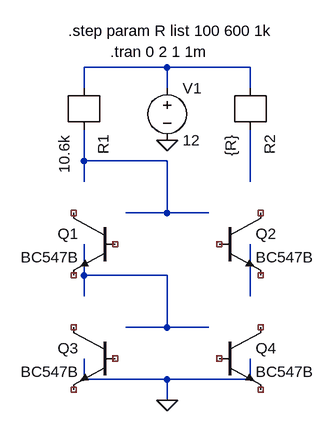
[diagram p0: schematic Marlon_1-2.asc]
Marlon_1-2.asc, the LTspice schematic file:
Version 4
SHEET 1 880 752
WIRE 288 224 160 224
WIRE 416 224 288 224
WIRE 160 256 160 224
WIRE 288 256 288 224
WIRE 416 256 416 224
WIRE 160 368 160 320
WIRE 288 368 160 368
WIRE 160 400 160 368
WIRE 416 400 416 320
WIRE 288 448 288 368
WIRE 288 448 224 448
WIRE 352 448 288 448
WIRE 160 544 160 496
WIRE 288 544 160 544
WIRE 160 576 160 544
WIRE 416 576 416 496
WIRE 288 624 288 544
WIRE 288 624 224 624
WIRE 352 624 288 624
WIRE 160 704 160 672
WIRE 288 704 160 704
WIRE 416 704 416 672
WIRE 416 704 288 704
WIRE 288 736 288 704
FLAG 288 336 0
FLAG 288 736 0
SYMBOL npn 208 448 M0
SYMATTR InstName Q1
SYMATTR Value BC547B
SYMBOL npn 368 448 R0
SYMATTR InstName Q2
SYMATTR Value BC547B
SYMBOL r 160 256 R90
SYMATTR InstName R1
SYMATTR Value 10.6k
SYMBOL r 416 256 R90
SYMATTR InstName R2
SYMATTR Value {R}
SYMBOL voltage 288 240 R0
SYMATTR InstName V1
SYMATTR Value 12
SYMBOL npn 208 624 M0
SYMATTR InstName Q3
SYMATTR Value BC547B
SYMBOL npn 368 624 R0
SYMATTR InstName Q4
SYMATTR Value BC547B
TEXT 200 200 Left 2 !.tran 0 2 1 1m
TEXT 136 168 Left 2 !.step param R list 100 600 1k

The netlist it stands for:
* Marlon_1-2.asc
* Q1: BC547B (symbol npn not certain, pin order unknown); nets seen at it: 0
* Q2: BC547B (symbol npn not certain, pin order unknown); nets seen at it: 0
R1 N002 N001 10.6k
R2 N003 N001 {R}
V1 N001 0 12
* Q3: BC547B (symbol npn not certain, pin order unknown); nets seen at it: 0
* Q4: BC547B (symbol npn not certain, pin order unknown); nets seen at it: 0
.tran 0 2 1 1m
.step param R list 100 600 1k
.backanno
.end